# Altium schematic sheet Схема блока LoRa_RAK3172.SchDoc
size 420 x 297 mm; Address1: Address1; Address2: Address2; Address3: Address3; Address4: Address4; DocumentNumber: АБВГ.123456.001 Э3; SheetNumber: 1; Scale: 1:1; DocumentType: Схема электрическая принципиальная; FirstReferrence: АБВГ.123456.001
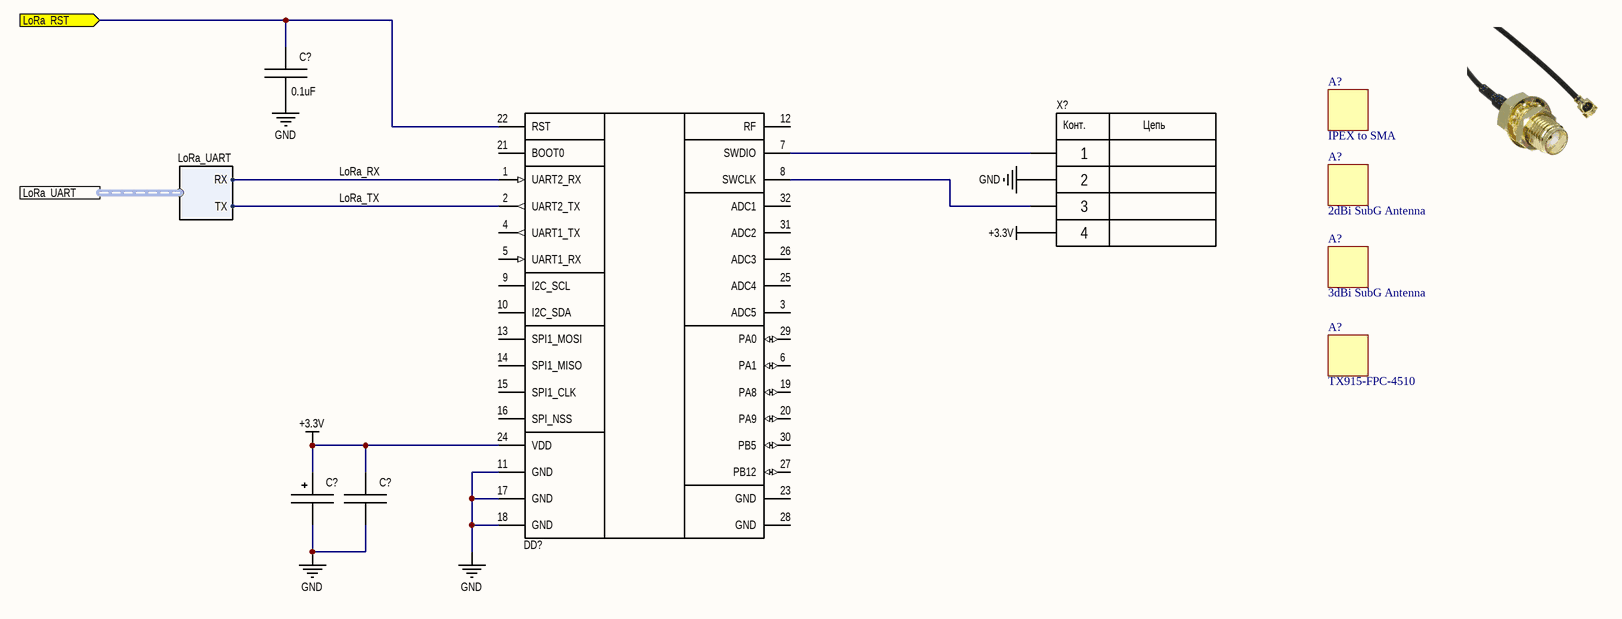
[diagram p0: Схема блока LoRa_RAK3172.SchDoc]

## Parts
(Parts that share a designator on the sheet are numbered #1, #2 ... from top to bottom, then left to right.)
A?#1  IPEX to SMA  (mechanical)
A?#2  2dBi SubG Antenna  (mechanical)
A?#3  3dBi SubG Antenna  (mechanical)
A?#4  TX915-FPC-4510  (mechanical)
C?#1  0.1uF  [CH0603C]
C?#2  *  [TANTAL_A]  (value not drawn)
C?#3  *  [CH0603C]  (value not drawn)
DD?  RAK3172  [MOD: RAK3172]  (value not drawn)
X?  61300411121  [CON: PLS-4]  (value not drawn)

## Ports
LoRa_RST (in), LoRa_UART (harness LoRa_UART)

## Harnesses
LoRa_UART: RX, TX

## Nets
+3.3V: C?#2.1 C?#3.1 DD?.24(VDD) X?.4
GND: C?#1.2 C?#2.2 C?#3.2 DD?.11(GND) DD?.17(GND) DD?.18(GND) X?.2
LoRa_RST: C?#1.1 DD?.22(RST) ; port LoRa_RST
LoRa_RX: DD?.1(UART2_RX) ; port LoRa_UART.RX
LoRa_TX: DD?.2(UART2_TX) ; port LoRa_UART.TX
NetDD?_7: DD?.7(SWDIO) X?.1
NetDD?_8: DD?.8(SWCLK) X?.3

Not connected (* = marked no-connect by the designer): DD? 3(ADC5) 4(UART1_TX) 5(UART1_RX) 6(PA1) 9(I2C_SCL) 10(I2C_SDA) 12(RF) 13(SPI1_MOSI) 14(SPI1_MISO) 15(SPI1_CLK) 16(SPI_NSS) 19(PA8) 20(PA9) 21(BOOT0) 23(GND) 25(ADC4) 26(ADC3) 27(PB12) 28(GND) 29(PA0) 30(PB5) 31(ADC2) 32(ADC1)

## Notes on the sheet
- Подп. и дата
- Инв. № дубл.
- Взам. инв. №
- Инв. № подл.
- Изм.
- Лист
- № докум.
- Подп.
- Дата
- 2.106-A3
- Копировал
- Формат А3
- (in symbol 4-Connector) Конт.; Цепь

## Library data of the parts
A?#1 = Mechanical_component: IPEX to SMA adapter cable; Manufacturer 1: Adam Equipment; Manufacturer Part Number 1: CA-DKCA0-305L0-AJI0-O; Supplier 1: Digi-Key; Supplier Part Number 1: 2057-CA-DKCA0-305L0-AJI0-O-ND; RoHS: No
A?#2 = Mechanical_component: Manufacturer 1: 5; Manufacturer Part Number 1: 2dBi SubG Antenna; Supplier Unit Price 1: *
A?#3 = Mechanical_component: Manufacturer 1: RAK; Manufacturer Part Number 1: 3dBi SubG Antenna; Supplier Unit Price 1: 7
A?#4 = Mechanical_component: TX915-FPC-4510 868~930MHz adhesive antenna; Manufacturer 1: EBYTE; Manufacturer Part Number 1: TX915-FPC-4510; Supplier Unit Price 1: 0,28
C?#1 = Capacitor: Manufacturer: Samsung Electro-Mechanics; Model: CL10B104KB8NNNC; HelpURL: https://www.digikey.com/en/products/detail/samsung-electro-mechanics/CL10B104KB8NNNC/3886658?s=N4IgTCBcDaIMIBkCMAGAQqgLAaTQDgDki4QBdAXyA; ComponentKind: 0603 (1608 Metric); Value: 0.1uF
C?#2 = TantalCap: Manufacturer: *; Model: *; HelpURL: *; ComponentKind: *; Value: *
C?#3 = Capacitor: Manufacturer: *; Model: *; HelpURL: *; ComponentKind: *; Value: *
DD? = RAK3172: LPWAN Module; Manufacturer: RAK; Model: RAK3172; ComponentKind: SMD; HelpURL: https://docs.rakwireless.com/Product-Categories/WisDuo/RAK3172-Module/Overview/#product-description
X? = 4-Connector: Manufacturer: Würth Elektronik; Model: 61300411121; HelpURL: https://www.digikey.com/en/products/detail/w%C3%BCrth-elektronik/61300411121/4846827?s=N4IgTCBcDaIGwEYDMAGFAWBWwJAXQF8g; ComponentKind: Through Hole 4 position